# EAGLE design Spaceship.Controller (EAGLE 7.2.0)
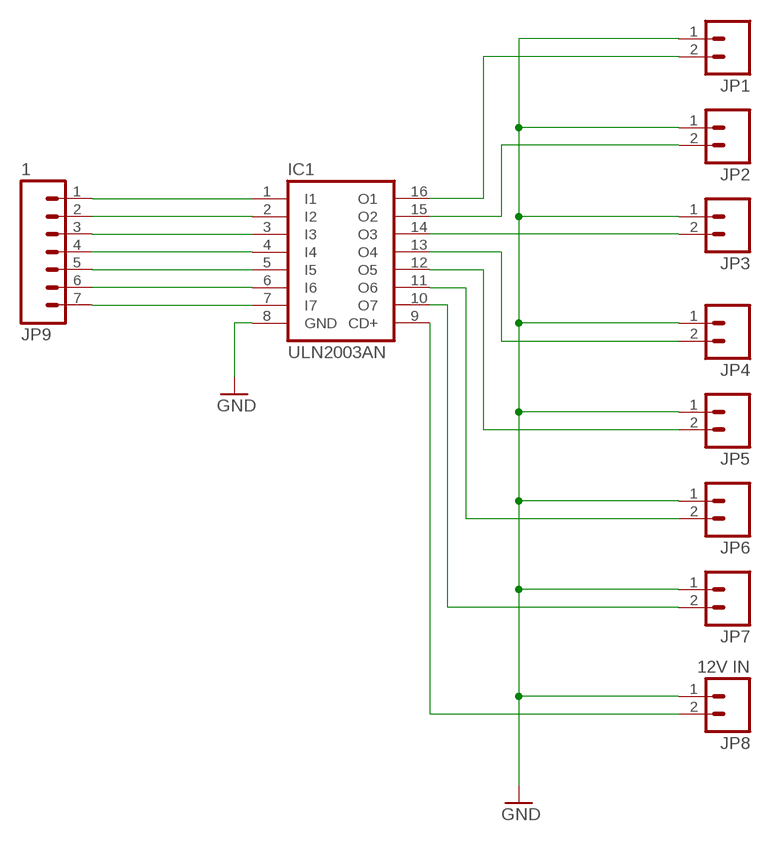
[diagram p0: schematic, sheet 1]

## Parts
IC1  ULN2003AN  [DIL16]
JP1  M023.5MM_LOCK  [SCREWTERMINAL-3.5MM-2_LOCK]
JP2  M023.5MM_LOCK  [SCREWTERMINAL-3.5MM-2_LOCK]
JP3  M023.5MM_LOCK  [SCREWTERMINAL-3.5MM-2_LOCK]
JP4  M023.5MM_LOCK  [SCREWTERMINAL-3.5MM-2_LOCK]
JP5  M023.5MM_LOCK  [SCREWTERMINAL-3.5MM-2_LOCK]
JP6  M023.5MM_LOCK  [SCREWTERMINAL-3.5MM-2_LOCK]
JP7  M023.5MM_LOCK  [SCREWTERMINAL-3.5MM-2_LOCK]
JP8  12V IN  M023.5MM_LOCK  [SCREWTERMINAL-3.5MM-2_LOCK]
JP9  1  M07LONGPADS  [1X07_LONGPADS]

## Nets
GND: IC1.8(GND) JP1.1 JP2.1 JP3.1 JP4.1 JP5.1 JP6.1 JP7.1 JP8.1
N$1: IC1.13(O4) JP4.2
N$2: IC1.9(CD+) JP8.2
N$3: IC1.1(I1) JP9.1
N$4: IC1.2(I2) JP9.2
N$5: IC1.12(O5) JP5.2
N$6: IC1.3(I3) JP9.3
N$7: IC1.4(I4) JP9.4
N$8: IC1.5(I5) JP9.5
N$9: IC1.11(O6) JP6.2
N$10: IC1.10(O7) JP7.2
N$11: IC1.6(I6) JP9.6
N$12: IC1.14(O3) JP3.2
N$13: IC1.15(O2) JP2.2
N$14: IC1.16(O1) JP1.2
N$15: IC1.7(I7) JP9.7

## Library data of the parts
IC1 = uln-udn:ULN2003A: DRIVER ARRAY
JP1-JP8 = SparkFun-Connectors:M02: Standard 2-pin 0.1" header. Use with - straight break away headers ( PRT-00116) - right angle break away headers (PRT-00553) - swiss pins (PRT-00743) - machine pins (PRT-00117) - female headers (PRT-00115) Molex polarized connector foot print use with: PRT-08233 with associated crimp pins and housings. 2.54_SCREWTERM for use with PRT-10571. 3.5mm Screw Terminal footprints for PRT-08084 5mm Screw Terminal footprints for use with PRT-08432; PROD_ID: CONN-08399
JP9 = SparkFun-Connectors:M07: Header 7 Standard 7-pin 0.1" header. Use with straight break away headers (SKU : PRT-00116), right angle break away headers (PRT-00553), swiss pins (PRT-00743), machine pins (PRT-00117), and female headers (PRT-00115). NOTES ON THE VARIANTS LOCK and LOCK_LONGPADS... This footprint was designed to help hold the alignment of a through-hole component (i.e. 7-pin header) while soldering it into place. You may notice that each hole has been shifted either up or down by 0.005 of an inch from it's more standard position (which is usually a perfectly straight line). This slight alteration caused the pins (the squares in the middle) to touch the edges of the holes. Because they are alternating, it causes a "brace" to hold the header in place. 0.005 has proven to be the perfect amount of "off-center" position when using our standard breakaway headers. Although looks a little odd when you look at the bare footprint, once you have a header in there, the alteration is very hard to notice. Also, if you push a header all the way into place, it is covered up entirely on the bottom side. This idea of altering the position of holes to aid alignment will be further integrated into the Sparkfun Library for other footprints. It can help hold any component with 3 or more connection pins.

## Board
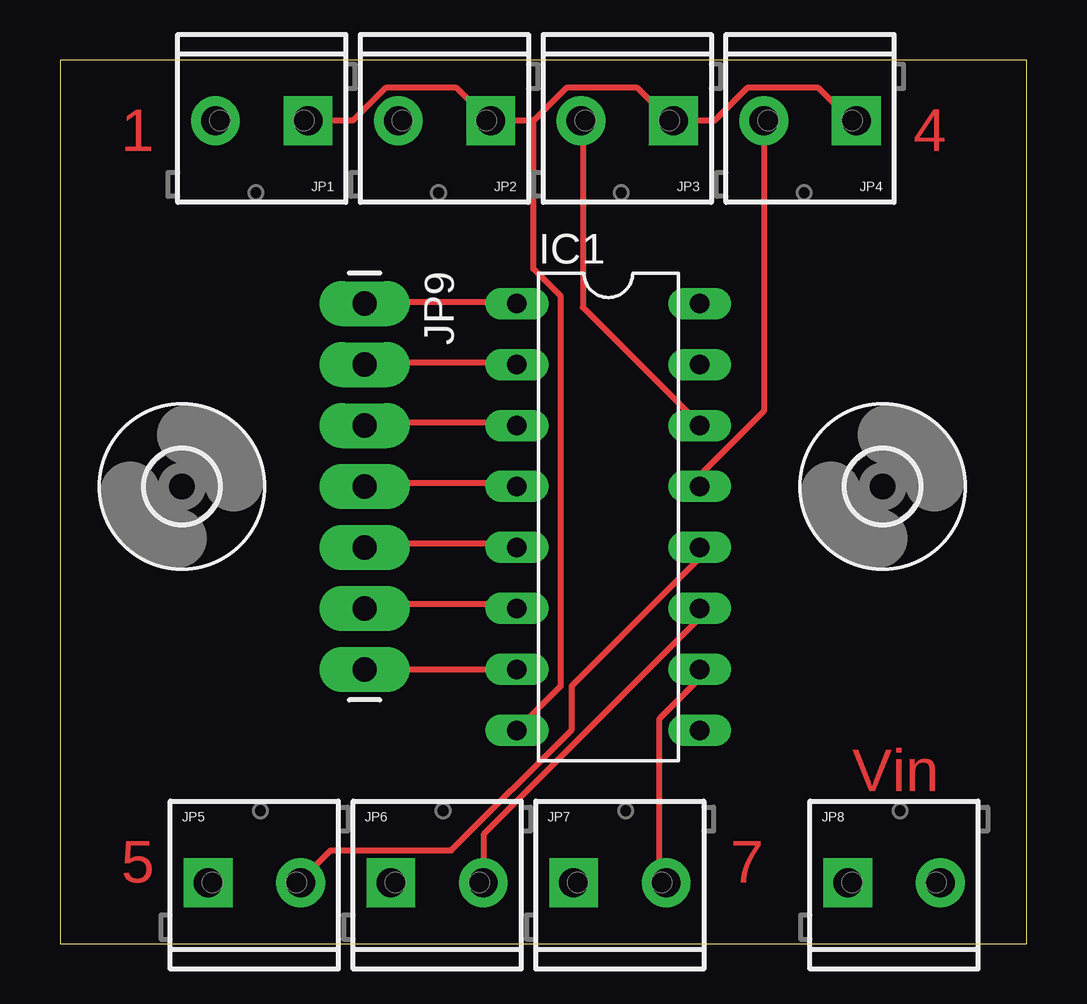
[diagram p1: board, top side]
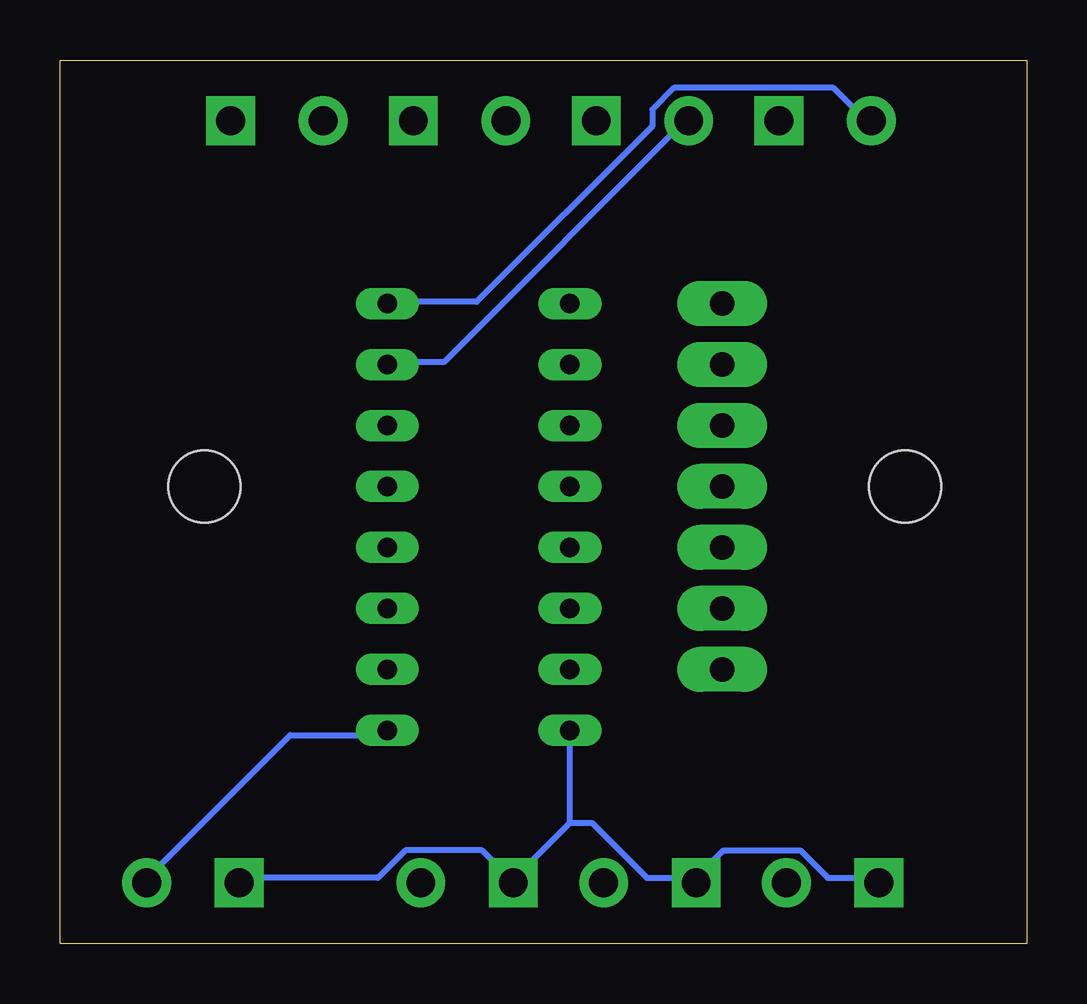
[diagram p2: board, bottom side, seen from below]

Size 40.31 x 36.82 mm. Coordinates in mm from the lower left corner, seen from the top.
Outline: 0,0 40.31,0 40.31,36.82 0,36.82 0,0
Copper layers (1*16): Top 0.035mm / dielectric 1.5mm / Bottom 0.035mm
Design rules "default": minimum track width 10mil, minimum drill 24mil, track to track 8mil, track to pad 8mil, pad to pad 8mil, via to via 8mil, smd to smd 8mil, copper to edge 40mil, drill to drill 8mil, minimum pad ring 10mil, minimum via ring 8mil, stop-mask expansion 4mil, vias tented up to drill 0mil, thermal gap 10mil

### Footprints (pad centres in the part's own frame; a part is rotated, then mirrored left to right if it is on the bottom)
3,0 = hole 3: 0,0
DIL16 = drill 0.813 long: 1 -8.89,-3.81; 2 -6.35,-3.81; 3 -3.81,-3.81; 4 -1.27,-3.81; 5 1.27,-3.81; 6 3.81,-3.81; 7 6.35,-3.81; 8 8.89,-3.81; 9 8.89,3.81; 10 6.35,3.81; 11 3.81,3.81; 12 1.27,3.81; 13 -1.27,3.81; 14 -3.81,3.81; 15 -6.35,3.81; 16 -8.89,3.81
SCREWTERMINAL-3.5MM-2_LOCK = drill 1.2 pad 2.032 square: 1 -0.178,0 | drill 1.2 pad 2.032: 2 3.678,0
1X07_LONGPADS = drill 1.016 pad 1.88 long: 1 0,0; 2 2.54,0; 3 5.08,0; 4 7.62,0; 5 10.16,0; 6 12.7,0; 7 15.24,0

### Placement (x,y rotation side)
H3  [3,0]  5.08,19.05 0 top
H4  [3,0]  34.29,19.05 0 top
IC1  22.86,17.78 270 top
JP1  10.16,34.29 180 top
JP2  17.78,34.29 180 top
JP3  25.4,34.29 180 top
JP4  33.02,34.29 180 top
JP5  6.35,2.54 0 top
JP6  13.97,2.54 0 top
JP7  21.59,2.54 0 top
JP8  33.02,2.54 0 top
JP9  12.7,26.67 270 top

### Tracks (layer width: path | path; a pad name or v marks a point on that pad's centre or on a via)
GND
  Top 0.254: JP1.1 12.19,34.29 13.56,35.66 16.53,35.66 17.91,34.29 JP2.1 19.74,34.29 | JP4.1 32.99,34.29 31.62,35.66 28.65,35.66 27.28,34.29 JP3.1 25.45,34.29 24.08,35.66 21.11,35.66 19.74,34.29 | 19.74,34.29 19.74,28.12 20.88,26.98 20.88,10.74 19.05,8.91 IC1.8
  Bottom 0.254: 13.79,2.74 12.65,3.89 9.45,3.89 8.31,2.74 6.25,2.74 JP5.1 | 19.05,5.03 IC1.8 | 19.05,5.03 21.34,2.74 JP7.1 21.56,2.74 22.71,3.89 25.91,3.89 27.05,2.74 32.77,2.74 JP8.1 | 13.79,2.74 15.85,2.74 18.14,5.03 19.05,5.03 | 13.79,2.74 JP6.1
N$1
  Top 0.254: IC1.13 26.82,19.2 26.82,19.66 29.34,22.17 JP4.2
N$2
  Bottom 0.254: IC1.9 26.82,8.69 30.71,8.69 36.65,2.74 JP8.2
N$3
  Top 0.254: IC1.1 19.05,26.75 12.88,26.75 JP9.1
N$4
  Top 0.254: IC1.2 19.05,24.23 12.88,24.23 JP9.2
N$5
  Top 0.254: IC1.12 26.59,16.46 26.59,16 21.34,10.74 21.34,8.91 16.31,3.89 11.28,3.89 10.13,2.74 JP5.2
N$6
  Top 0.254: IC1.3 19.05,21.72 12.88,21.72 JP9.3
N$7
  Top 0.254: IC1.4 19.05,19.2 12.88,19.2 JP9.4
N$8
  Top 0.254: IC1.5 19.05,16.69 12.88,16.69 JP9.5
N$9
  Top 0.254: IC1.11 26.59,13.95 26.59,13.49 17.68,4.57 17.68,2.74 JP6.2
N$10
  Top 0.254: IC1.10 26.59,11.43 26.59,10.97 24.99,9.37 24.99,2.97 25.22,2.74 JP7.2
N$11
  Top 0.254: IC1.6 19.05,14.17 12.88,14.17 JP9.6
N$12
  Top 0.254: IC1.14 26.59,21.72 21.79,26.52 21.79,34.29 JP3.2
N$13
  Bottom 0.254: IC1.15 26.59,24.23 24.31,24.23 14.25,34.29 JP2.2
N$14
  Bottom 0.254: IC1.16 26.59,26.75 22.94,26.75 15.62,34.06 15.62,34.75 14.71,35.66 8.08,35.66 6.71,34.29 JP1.2
N$15
  Top 0.254: JP9.7 IC1.7

### Text on the board
Top: 1 | 4 | Vin | 5 | 7